# EAGLE design Shruti-FrontPanel-v05 (EAGLE 5.09)
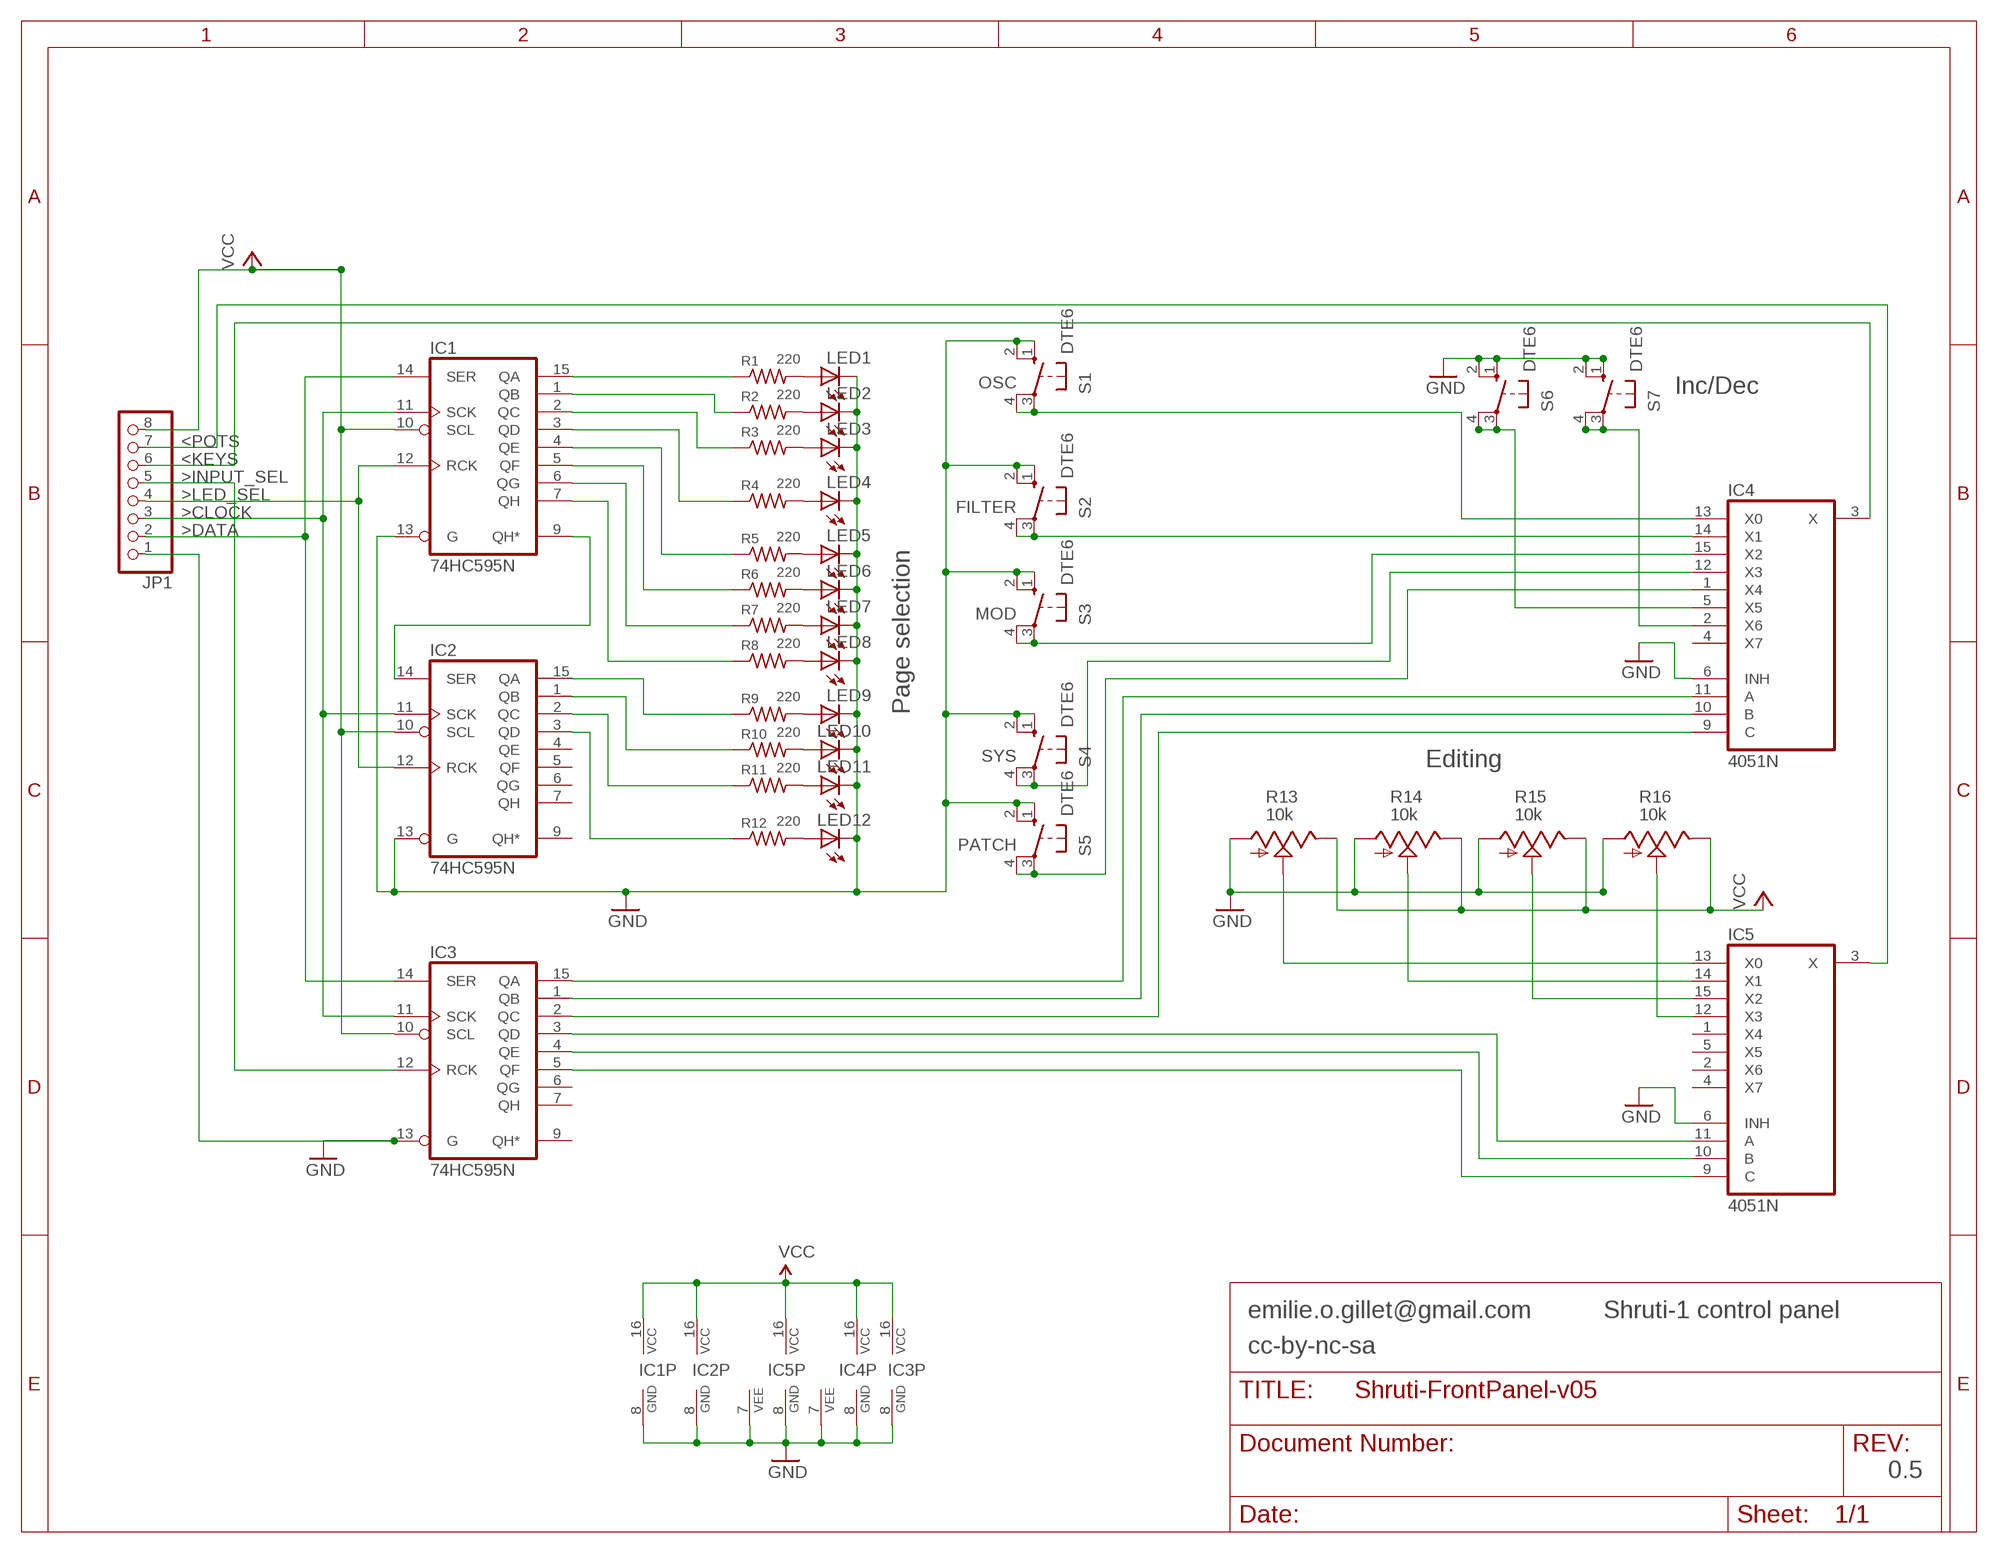
[diagram p0: schematic, sheet 1]

## Parts
IC1  74HC595N  [DIL16]
IC2  74HC595N  [DIL16]
IC3  74HC595N  [DIL16]
IC4  4051N  [DIL16]
IC5  4051N  [DIL16]
JP1  PINHD-1X8  [1X08]
LED1  LED3MM  [LED3MM]
LED2  LED3MM  [LED3MM]
LED3  LED3MM  [LED3MM]
LED4  LED3MM  [LED3MM]
LED5  LED3MM  [LED3MM]
LED6  LED3MM  [LED3MM]
LED7  LED3MM  [LED3MM]
LED8  LED3MM  [LED3MM]
LED9  LED3MM  [LED3MM]
LED10  LED3MM  [LED3MM]
LED11  LED3MM  [LED3MM]
LED12  LED3MM  [LED3MM]
R1  220  R-US_0204/7  [0204/7]
R2  220  R-US_0204/7  [0204/7]
R3  220  R-US_0204/7  [0204/7]
R4  220  R-US_0204/7  [0204/7]
R5  220  R-US_0204/7  [0204/7]
R6  220  R-US_0204/7  [0204/7]
R7  220  R-US_0204/7  [0204/7]
R8  220  R-US_0204/7  [0204/7]
R9  220  R-US_0204/7  [0204/7]
R10  220  R-US_0204/7  [0204/7]
R11  220  R-US_0204/7  [0204/7]
R12  220  R-US_0204/7  [0204/7]
R13  10k  POT_US  [ALPS_POT_SFE]
R14  10k  POT_US  [ALPS_POT_SFE]
R15  10k  POT_US  [ALPS_POT_SFE]
R16  10k  POT_US  [ALPS_POT_SFE]
S1  DTE6  40-XX  [B3F-40XX]
S2  DTE6  40-XX  [B3F-40XX]
S3  DTE6  40-XX  [B3F-40XX]
S4  DTE6  40-XX  [B3F-40XX]
S5  DTE6  40-XX  [B3F-40XX]
S6  DTE6  40-XX  [B3F-40XX]
S7  DTE6  40-XX  [B3F-40XX]

## Nets
<KEYS: IC4.3(X) JP1.6
<POTS: IC5.3(X) JP1.7
>CLOCK: IC1.11(SCK) IC2.11(SCK) IC3.11(SCK) JP1.3
>DATA: IC1.14(SER) IC3.14(SER) JP1.2
>INPUT_SEL: IC3.12(RCK) JP1.5
>LED_SEL: IC1.12(RCK) IC2.12(RCK) JP1.4
GND: IC1.8(GND) IC1.13(G) IC2.8(GND) IC2.13(G) IC3.8(GND) IC3.13(G) IC4.6(INH) IC4.7(VEE) IC4.8(GND) IC5.6(INH) IC5.7(VEE) IC5.8(GND) JP1.1 LED1.K(C) LED2.K(C) LED3.K(C) LED4.K(C) LED5.K(C) LED6.K(C) LED7.K(C) LED8.K(C) LED9.K(C) LED10.K(C) LED11.K(C) LED12.K(C) R13.P$3(A) R14.P$3(A) R15.P$3(A) R16.P$3(A) S1.1(S) S1.2(S1) S2.1(S) S2.2(S1) S3.1(S) S3.2(S1) S4.1(S) S4.2(S1) S5.1(S) S5.2(S1) S6.1(S) S6.2(S1) S7.1(S) S7.2(S1)
N$1: IC1.9(QH*) IC2.14(SER)
N$2: LED1.A R1.2
N$3: LED2.A R2.2
N$4: LED3.A R3.2
N$5: LED4.A R4.2
N$6: LED5.A R5.2
N$7: LED6.A R6.2
N$8: LED7.A R7.2
N$9: LED9.A R9.2
N$10: LED10.A R10.2
N$11: LED11.A R11.2
N$12: LED12.A R12.2
N$13: IC1.15(QA) R1.1
N$14: IC1.1(QB) R2.1
N$15: IC1.2(QC) R3.1
N$16: IC1.3(QD) R4.1
N$17: IC1.4(QE) R5.1
N$18: IC1.5(QF) R6.1
N$19: IC1.6(QG) R7.1
N$20: IC1.7(QH) R8.1
N$21: LED8.A R8.2
N$22: IC2.15(QA) R9.1
N$23: IC2.1(QB) R10.1
N$24: IC2.2(QC) R11.1
N$25: IC3.15(QA) IC4.11(A)
N$26: IC3.1(QB) IC4.10(B)
N$27: IC2.3(QD) R12.1
N$31: IC3.2(QC) IC4.9(C)
N$32: IC3.3(QD) IC5.11(A)
N$33: IC3.4(QE) IC5.10(B)
N$34: IC3.5(QF) IC5.9(C)
N$35: IC5.13(X0) R13.P$2(S)
N$36: IC4.5(X5) S6.3(P) S6.4(P1)
N$37: IC5.14(X1) R14.P$2(S)
N$38: IC5.15(X2) R15.P$2(S)
N$39: IC5.12(X3) R16.P$2(S)
N$40: IC4.2(X6) S7.3(P) S7.4(P1)
N$41: IC4.13(X0) S1.3(P) S1.4(P1)
N$42: IC4.14(X1) S2.3(P) S2.4(P1)
N$43: IC4.15(X2) S3.3(P) S3.4(P1)
N$44: IC4.12(X3) S4.3(P) S4.4(P1)
N$45: IC4.1(X4) S5.3(P) S5.4(P1)
VCC: IC1.10(SCL) IC1.16(VCC) IC2.10(SCL) IC2.16(VCC) IC3.10(SCL) IC3.16(VCC) IC4.16(VCC) IC5.16(VCC) JP1.8 R13.P$1(E) R14.P$1(E) R15.P$1(E) R16.P$1(E)
Unconnected: IC2.4(QE) IC2.5(QF) IC2.6(QG) IC2.7(QH) IC2.9(QH*) IC3.6(QG) IC3.7(QH) IC3.9(QH*) IC4.4(X7) IC5.1(X4) IC5.2(X6) IC5.4(X7) IC5.5(X5)

## Notes on the sheet
- OSC
- Inc/Dec
- FILTER
- MOD
- Page selection
- SYS
- Editing
- PATCH
- emilie.o.gillet@gmail.com | Shruti-1 control panel
- cc-by-nc-sa
- 0.5

## Library data of the parts
IC1-IC3 = 74xx-eu:74*595: 8-bit SHIFT REGISTER, output latch
IC4 IC5 = 40xx:4051: 8-channel ANALOG MULTIPLEXER
JP1 = pinhead:PINHD-1X8: PIN HEADER
LED1-LED12 = led:LED: LED OSRAM: - CHIPLED LG R971, LG N971, LY N971, LG Q971, LY Q971, LO R971, LY R971 LH N974, LH R974 LS Q976, LO Q976, LY Q976 LO Q996 - Hyper CHIPLED LW Q18S LB Q993, LB Q99A, LB R99A - SideLED LS A670, LO A670, LY A670, LG A670, LP A670 LB A673, LV A673, LT A673, LW A673 LH A674 LY A675 LS A676, LA A676, LO A676, LY A676, LW A676 LS A679, LY A679, LG A679 - Hyper Micro SIDELED® LS Y876, LA Y876, LO Y876, LY Y876 LT Y87S - SmartLED LW L88C, LW L88S LB L89C, LB L89S, LG L890 LS L89K, LO L89K, LY L89K LS L896, LA L896, LO L896, LY L896 - TOPLED LS T670, LO T670, LY T670, LG T670, LP T670 LSG T670, LSP T670, LSY T670, LOP T670, LYG T670 LG T671, LOG T671, LSG T671 LB T673, LV T673, LT T673, LW T673 LH T674 LS T676, LA T676, LO T676, LY T676, LB T676, LH T676, LSB T676, LW T676 LB T67C, LV T67C, LT T67C, LS T67K, LO T67K, LY T67K, LW E67C LS E67B, LA E67B, LO E67B, LY E67B, LB E67C, LV E67C, LT E67C LW T67C LS T679, LY T679, LG T679 LS T770, LO T770, LY T770, LG T770, LP T770 LB T773, LV T773, LT T773, LW T773 LH T774 LS E675, LA E675, LY E675, LS T675 LS T776, LA T776, LO T776, LY T776, LB T776 LHGB T686 LT T68C, LB T68C - Hyper Mini TOPLED® LB M676 - Mini TOPLED Santana® LG M470 LS M47K, LO M47K, LY M47K Source: http://www.osram.convergy.de LUXEON: - LUMILED® LXK2-PW12-R00, LXK2-PW12-S00, LXK2-PW14-U00, LXK2-PW14-V00 LXK2-PM12-R00, LXK2-PM12-S00, LXK2-PM14-U00 LXK2-PE12-Q00, LXK2-PE12-R00, LXK2-PE12-S00, LXK2-PE14-T00, LXK2-PE14-U00 LXK2-PB12-K00, LXK2-PB12-L00, LXK2-PB12-M00, LXK2-PB14-N00, LXK2-PB14-P00, LXK2-PB14-Q00 LXK2-PR12-L00, LXK2-PR12-M00, LXK2-PR14-Q00, LXK2-PR14-R00 LXK2-PD12-Q00, LXK2-PD12-R00, LXK2-PD12-S00 LXK2-PH12-R00, LXK2-PH12-S00 LXK2-PL12-P00, LXK2-PL12-Q00, LXK2-PL12-R00 Source: www.luxeon.com KINGBRIGHT: KA-3528ASYC Source: www.kingbright.com
R1-R12 = resistor:R-US_: RESISTOR, American symbol
R13-R16 = pot-alps:POT_US
S1-S7 = switch-omron:40-XX: OMRON SWITCH

## Board
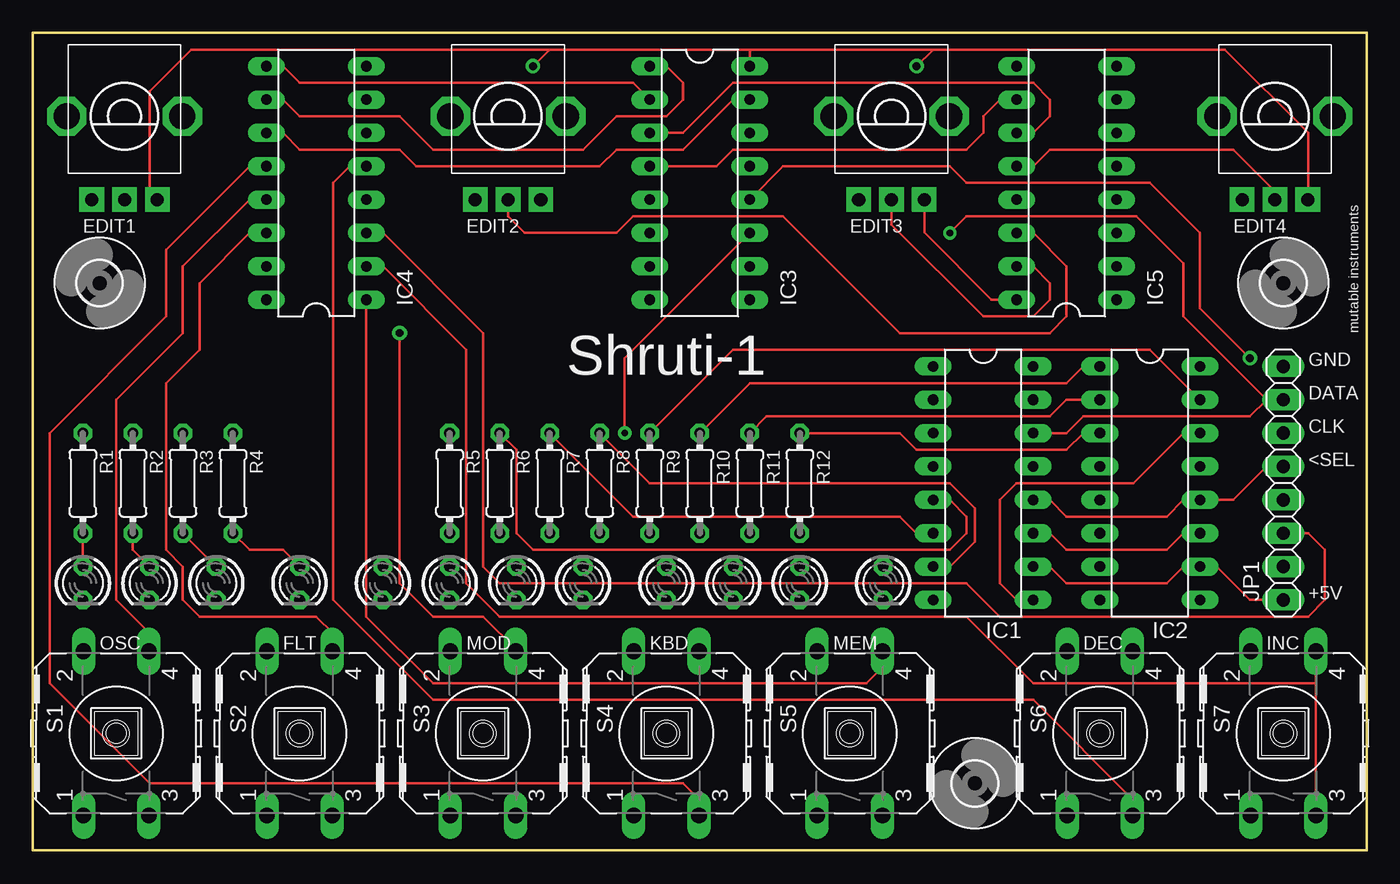
[diagram p1: board, top side]
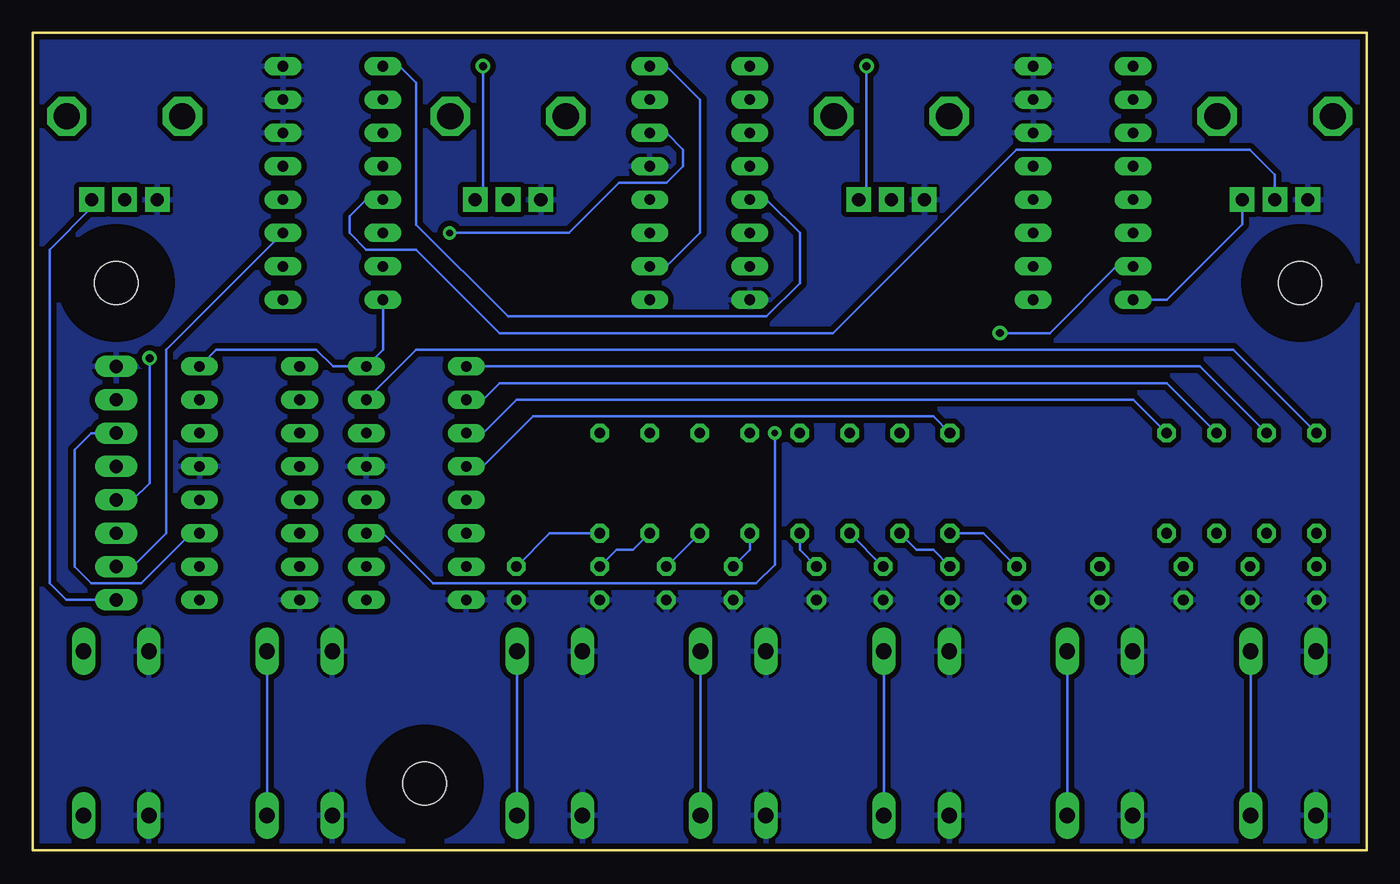
[diagram p2: board, bottom side, seen from below]

Size 101.6 x 62.23 mm. Coordinates in mm from the lower left corner, seen from the top.
Outline: 0,62.22 101.6,62.22 101.6,0 0,0 0,62.22
Outline: 0,62.23 0,62.22
Copper layers (1*16): Top 0.035mm / dielectric 1.5mm / Bottom 0.035mm
Design rules "SparkFun *": minimum track width 8mil, minimum drill 20mil, track to track 8mil, track to pad 14mil, pad to pad 8mil, via to via 8mil, smd to smd 8mil, copper to edge 10mil, drill to drill 8mil, minimum pad ring 12mil, minimum via ring 10mil, stop-mask expansion 4mil, vias tented up to drill 25mil, thermal gap 10mil

### Footprints (pad centres in the part's own frame; a part is rotated, then mirrored left to right if it is on the bottom)
DIL16 = drill 0.813 long: 1 -8.89,-3.81; 2 -6.35,-3.81; 3 -3.81,-3.81; 4 -1.27,-3.81; 5 1.27,-3.81; 6 3.81,-3.81; 7 6.35,-3.81; 8 8.89,-3.81; 9 8.89,3.81; 10 6.35,3.81; 11 3.81,3.81; 12 1.27,3.81; 13 -1.27,3.81; 14 -3.81,3.81; 15 -6.35,3.81; 16 -8.89,3.81
1X08 = drill 1.016 long: 1 -8.89,0; 2 -6.35,0; 3 -3.81,0; 4 -1.27,0; 5 1.27,0; 6 3.81,0; 7 6.35,0; 8 8.89,0
LED3MM = drill 0.813 octagon: A -1.27,0; K 1.27,0
0204/7 = drill 0.813 octagon: 1 -3.81,0; 2 3.81,0
ALPS_POT_SFE = drill 1 pad 1.88 square: P$1 -2.5,6.35; P$2 0,6.35; P$3 2.5,6.35 | drill 2 octagon: P$4 -4.4,0; P$5 4.4,0
B3F-40XX = drill 1.194 long: 1 -6.248,2.489; 2 6.248,2.489; 3 -6.248,-2.489; 4 6.248,-2.489
3,3 = hole 3.3: 0,0

### Placement (x,y rotation side)
IC1  72.39,27.94 270 top
IC2  85.09,27.94 270 top
IC3  50.8,50.8 270 top
IC4  21.59,50.8 90 top
IC5  78.74,50.8 90 top
JP1  95.25,27.94 270 top
LED1  3.81,20.32 270 top
LED2  8.89,20.32 270 top
LED3  13.97,20.32 270 top
LED4  20.32,20.32 270 top
LED5  26.67,20.32 270 top
LED6  31.75,20.32 270 top
LED7  36.83,20.32 270 top
LED8  41.91,20.32 270 top
LED9  48.26,20.32 270 top
LED10  53.34,20.32 270 top
LED11  58.42,20.32 270 top
LED12  64.77,20.32 270 top
R1  3.81,27.94 270 top
R2  7.62,27.94 270 top
R3  11.43,27.94 270 top
R4  15.24,27.94 270 top
R5  31.75,27.94 270 top
R6  35.56,27.94 270 top
R7  39.37,27.94 270 top
R8  43.18,27.94 270 top
R9  46.99,27.94 270 top
R10  50.8,27.94 270 top
R11  54.61,27.94 270 top
R12  58.42,27.94 270 top
R13  6.99,55.88 180 top
R14  36.2,55.88 180 top
R15  65.41,55.88 180 top
R16  94.61,55.88 180 top
S1  6.35,8.89 90 top
S2  20.32,8.89 90 top
S3  34.29,8.89 90 top
S4  48.26,8.89 90 top
S5  62.23,8.89 90 top
S6  81.28,8.89 90 top
S7  95.25,8.89 90 top
U$1  [3,3]  71.75,5.08 0 top
U$2  [3,3]  5.08,43.18 90 top
U$3  [3,3]  95.25,43.18 0 top
U$4  [SARASWATI]  27.3,33.02 0 top

### Tracks (layer width: path | path; a pad name or v marks a point on that pad's centre or on a via)
<KEYS
  Top 0.203: IC4.3 26.67,46.99 34.29,39.37 34.29,21.59 35.56,20.32 71.12,20.32 73.66,17.78 97.16,17.78 98.42,19.05 98.42,22.86 97.16,24.13 JP1.6
<POTS
  Bottom 0.203: JP1.7 93.98,21.59 91.44,24.13 91.44,38.1 IC5.3
>CLOCK  (via drill 0.51)
  Top 0.203: IC1.11 77.47,24.13 78.74,22.86 86.36,22.86 87.63,24.13 IC2.11 | IC3.11 45.09,37.47 v45.09,31.75
  Bottom 0.203: JP1.3 97.16,31.75 98.42,30.48 98.42,21.59 97.16,20.32 93.34,20.32 89.53,24.13 IC2.11 | v45.09,31.75 45.09,21.74 46.51,20.32 71.12,20.32 74.93,24.13 IC1.11
>DATA  (via drill 0.51)
  Top 0.203: IC1.14 78.74,31.75 80.01,33.02 92.71,33.02 93.98,34.29 | v69.85,46.99 71.12,48.26 84.04,48.26 87.63,44.67 87.63,40.64 93.98,34.29 | 93.98,34.29 JP1.2
  Bottom 0.203: v69.85,46.99 60.74,46.99 56.93,50.8 53.34,50.8 52.07,52.07 52.07,53.34 53.34,54.61 IC3.14
>INPUT_SEL  (via drill 0.6)
  Top 0.203: v92.71,37.47 88.9,41.27 88.9,46.99 85.09,50.8 71.12,50.8 69.85,52.07 57.15,52.07 IC3.12
  Bottom 0.203: v92.71,37.47 92.71,27.94 93.98,26.67 JP1.5
>LED_SEL
  Top 0.203: IC1.12 77.47,26.67 78.74,25.4 86.36,25.4 87.63,26.67 IC2.12 91.44,26.67 93.98,29.21 JP1.4
GND
  pour Bottom (isolate 0.406): 0.64,61.59 0.64,0.64 100.97,0.64 100.97,61.59
N$1
  Top 0.203: IC1.9 74.93,19.05 73.66,20.32 73.66,26.67 74.93,27.94 83.82,27.94 87.63,31.75 IC2.14
N$2
  Top 0.203: LED1.A R1.2
N$3
  Top 0.203: R2.2 7.62,22.86 LED2.A
N$4
  Top 0.203: R3.2 LED3.A
N$5
  Top 0.203: R4.2 16.51,22.86 19.05,22.86 LED4.A
N$6
  Bottom 0.203: R5.2 29.21,24.13 LED5.A
N$7
  Bottom 0.203: R6.2 34.29,22.86 33.02,22.86 LED6.A
N$8
  Bottom 0.203: LED7.A R7.2
N$9
  Bottom 0.203: R9.2 46.99,22.86 LED9.A
N$10
  Bottom 0.203: R10.2 LED10.A
N$11
  Bottom 0.203: R11.2 55.88,22.86 57.15,22.86 LED11.A
N$12
  Bottom 0.203: R12.2 62.23,24.13 LED12.A
N$13
  Bottom 0.203: R1.1 10.16,38.1 72.39,38.1 IC1.15
N$14
  Bottom 0.203: R2.1 12.7,36.83 IC1.1
N$15
  Bottom 0.203: R3.1 15.24,35.56 66.04,35.56 67.31,34.29 IC1.2
N$16
  Bottom 0.203: R4.1 17.78,34.29 64.77,34.29 67.31,31.75 IC1.3
N$17
  Bottom 0.203: R5.1 33.02,33.02 63.5,33.02 67.31,29.21 IC1.4
N$18
  Top 0.203: R6.1 36.83,30.48 36.83,24.13 38.1,22.86 69.85,22.86 71.12,24.13 71.12,25.4 69.85,26.67 IC1.5
N$19
  Top 0.203: R7.1 45.72,25.4 66.04,25.4 67.31,24.13 IC1.6
N$20
  Top 0.203: R8.1 46.99,27.94 69.85,27.94 71.75,26.04 71.75,23.5 69.85,21.59 IC1.7
N$21
  Bottom 0.203: R8.2 43.18,22.86 LED8.A
N$22
  Top 0.203: R9.1 53.34,38.1 85.09,38.1 IC2.15
N$23
  Top 0.203: R10.1 54.61,35.56 78.74,35.56 80.01,36.83 IC2.1
N$24
  Top 0.203: R11.1 55.88,33.02 77.47,33.02 78.74,34.29 IC2.2
N$25
  Top 0.203: IC4.11 19.05,54.61 20.32,53.34 27.94,53.34 29.21,52.07 43.18,52.07 44.45,53.34 49.53,53.34 53.34,57.15 IC3.15
N$26
  Top 0.203: IC4.10 19.05,57.15 20.32,55.88 27.94,55.88 30.48,53.34 41.91,53.34 44.45,55.88 48.26,55.88 49.53,57.15 49.53,58.42 48.26,59.69 IC3.1
N$27
  Top 0.203: R12.1 66.04,31.75 67.31,30.48 78.74,30.48 80.01,31.75 IC2.3
N$31
  Top 0.203: IC4.9 19.05,59.69 20.32,58.42 45.72,58.42 IC3.2
N$32
  Top 0.203: IC3.3 49.53,54.61 53.34,58.42 76.2,58.42 77.47,57.15 77.47,55.88 76.2,54.61 IC5.11
N$33
  Top 0.203: IC3.4 52.07,52.07 53.34,53.34 71.12,53.34 72.39,54.61 72.39,55.88 73.66,57.15 IC5.10
N$34
  Bottom 0.203: IC3.5 45.72,49.53 43.18,46.99 43.18,43.18 45.72,40.64 65.41,40.64 72.39,47.62 72.39,58.42 73.66,59.69 IC5.9
N$35
  Bottom 0.203: R13.P$2 6.99,51.44 8.89,53.34 26.67,53.34 40.64,39.37 66.04,39.37 72.39,45.72 76.2,45.72 77.47,46.99 77.47,48.26 76.2,49.53 IC5.13
N$36
  Top 0.203: IC4.5 24.13,52.07 22.86,50.8 22.86,19.05 30.48,11.43 76.2,11.43 83.77,3.86 S6.3
  Bottom 0.203: S6.3 S6.4
N$37
  Top 0.203: IC5.14 76.2,46.99 78.74,44.45 78.74,40.64 77.47,39.37 66.04,39.37 57.15,48.26 45.72,48.26 44.45,46.99 37.47,46.99 36.2,48.26 R14.P$2
N$38
  Top 0.203: R15.P$2 65.41,47.62 72.39,40.64 76.2,40.64 77.47,41.91 77.47,43.18 76.2,44.45 IC5.15
N$39
  Top 0.203: IC5.12 76.2,52.07 77.47,53.34 91.44,53.34 94.61,50.16 R16.P$2
N$40
  Top 0.203: 97.74,12.7 S7.3 97.74,2.59 | 97.74,12.7 S7.4 97.79,15.09 | IC4.2 26.67,44.45 33.02,38.1 33.02,20.32 35.56,17.78 71.12,17.78 76.2,12.7 97.74,12.7
N$41
  Top 0.203: IC4.13 16.51,49.53 11.43,44.45 11.43,39.37 6.35,34.29 6.35,19.05 8.89,16.51 8.89,15.19 S1.4
  Bottom 0.203: S1.3 S1.4
N$42
  Top 0.203: IC4.14 16.51,46.99 12.7,43.18 12.7,38.1 10.16,35.56 10.16,22.86 11.43,21.59 11.43,19.05 12.7,17.78 21.59,17.78 22.86,16.51 22.81,16.46 S2.4
  Bottom 0.203: S2.3 S2.4
N$43  (via drill 0.6)
  Top 0.203: S3.4 36.83,15.19 36.83,15.24 34.29,17.78 30.48,17.78 27.94,20.32 v27.94,39.37
  Bottom 0.203: S3.3 S3.4 | v27.94,39.37 24.13,39.37 19.05,44.45 IC4.15
N$44
  Top 0.203: IC4.12 16.51,52.07 10.16,45.72 10.16,40.64 1.27,31.75 1.27,12.7 8.89,5.08 49.53,5.08 50.8,3.81 50.8,2.54 S4.3
  Bottom 0.203: S4.3 S4.4
N$45
  Top 0.203: S5.4 64.77,15.09 64.77,13.97 63.5,12.7 30.48,12.7 25.4,17.78 IC4.1
  Bottom 0.203: S5.4 S5.3
VCC  (via drill 0.6)
  Top 0.203: IC1.10 77.47,21.59 78.74,20.32 86.36,20.32 87.63,21.59 IC2.10 90.17,21.59 92.71,19.05 JP1.8 | R13.P$1 8.89,50.12 8.89,57.78 12.06,60.96 38.73,60.96 | 38.73,60.96 54.61,60.96 | 54.61,60.96 68.58,60.96 | 68.58,60.96 90.81,60.96 97.16,54.61 97.16,49.57 R16.P$1 | 38.73,60.96 39.33,60.92 v38.1,59.69 | 68.58,60.96 v67.31,59.69 | R15.P$1 67.91,47.03 73.03,41.91 IC5.16 | 54.61,60.96 IC3.16
  Bottom 0.203: R13.P$1 9.48,47.66 15.24,41.91 IC4.16 | JP1.8 99.06,19.05 100.33,20.32 100.33,45.72 97.11,48.94 R16.P$1 | v38.1,59.69 38.1,50.12 R14.P$1 | v67.31,59.69 67.31,50.12 R15.P$1 | IC3.10 53.34,44.45 50.8,46.99 50.8,57.15 53.34,59.69 IC3.16 | IC5.16 74.93,38.1 IC1.16 78.74,36.83 80.01,38.1 87.63,38.1 IC2.16

### Text on the board
tPlace: GND | Shruti-1 | DATA | CLK | <SEL | +5V
tNames: EDIT1 | EDIT2 | EDIT3 | EDIT4 | mutable instruments | OSC | FLT | MOD | KBD | MEM | DEC | INC
License: ol.gillet@gmail.com | cc-by-nc-sa 3.0
200bmp: v0.5 revisited
201bmp: Platypus controlled